# Altium schematic sheet Power Supply.SchDoc: =ProjectTitle
size 297 x 209 mm; Address1: Address1; Address2: Address2; Address3: Address3; Address4: Address4; SheetNumber: 1; SheetTotal: 16; Scale: 1:1; DocumentType: Схема электрическая принципиальная
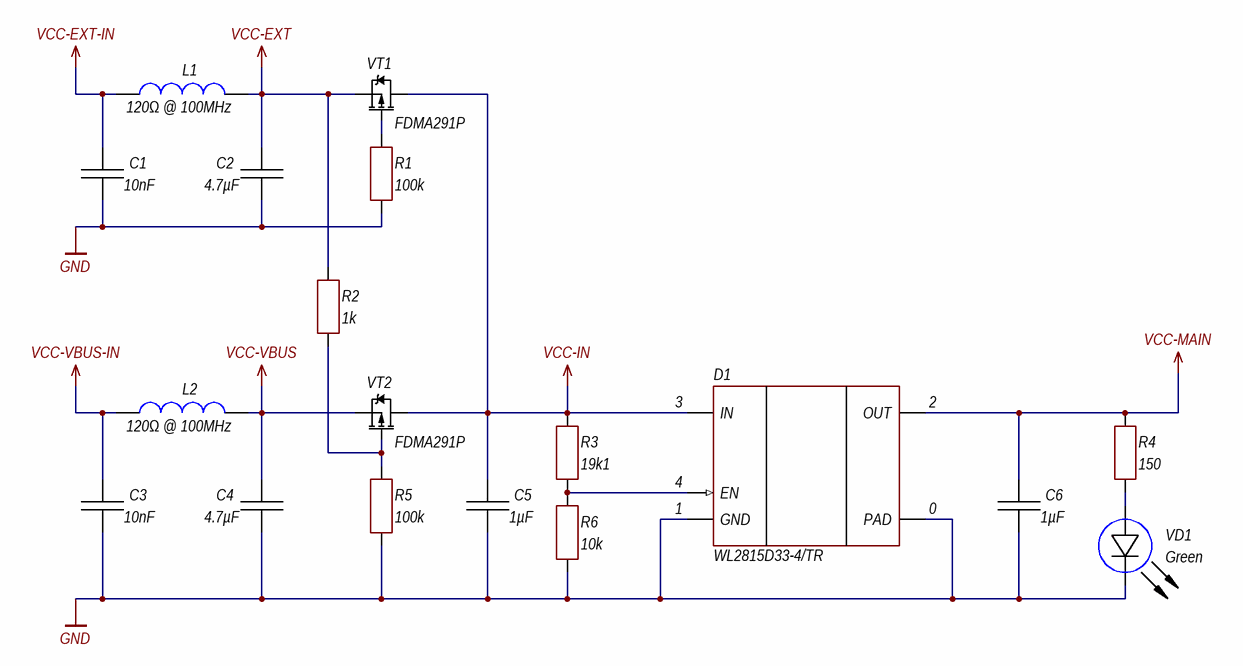
[diagram p0: Power Supply.SchDoc]

## Parts
C1  10nF  [CH0805CM]
C2  4.7µF  [CH0805CM]
C3  10nF  [CH0805CM]
C4  4.7µF  [CH0805CM]
C5  1µF  [CH0402C]
C6  1µF  [CH0402C]
D1  WL2815D33-4/TR  [DFN1010-4]
L1  120Ω @ 100MHz  [CH0805LM]
L2  120Ω @ 100MHz  [CH0805LM]
R1  100k  [CH0402R]
R2  1k  [CH0402R]
R3  19k1  [CH0402R]
R4  150  [CH0402R]
R5  100k  [CH0402R]
R6  10k  [CH0402R]
VD1  Green  [CH0402LG]
VT1  FDMA291P  [MicroFET 2x2]
VT2  FDMA291P  [MicroFET 2x2]

## Nets
GND: C1.1 C2.1 C3.1 C4.1 C5.1 C6.1 D1.0(PAD) D1.1(GND) R1.1 R5.1 R6.1 VD1.2(C)
VCC-EXT: C2.2 L1.1 R2.2 VT1.3(S)
VCC-EXT-IN: C1.2 L1.2
VCC-IN: C5.2 D1.3(IN) R3.2 VT1.2(D) VT2.2(D)
VCC-MAIN: C6.2 D1.2(OUT) R4.2
VCC-VBUS: C4.2 L2.1 VT2.3(S)
VCC-VBUS-IN: C3.2 L2.2
NetD1_4: D1.4(EN) R3.1 R6.2
NetR1_2: R1.2 VT1.1(G)
NetR2_1: R2.1 R5.2 VT2.1(G)
NetR4_1: R4.1 VD1.1(A)

## Notes on the sheet
- Утв.
- Н.контр.
- Т.контр.
- Пров.
- Разраб.
- Изм.
- Лист
- № докум.
- Подп.
- Дата
- Копировал
- Формат А4
- Лит.
- Листов
- Масса
- Масштаб

## Library data of the parts
C1-C6 = Capacitor: Manufacturer: *; Model: *; HelpURL: *; ComponentKind: *
  C1 C3: Value: 10nF
  C2 C4: Value: 4.7µF
  C5 C6: Value: 1µF
D1 = WL2815: LDO; Model: WL2815D33-4/TR; HelpURL: https://www.lcsc.com/product-detail/Linear-Voltage-Regulators-LDO_WILLSEMI-Will-Semicon-WL2815D33-4-TR_C506126.html; ComponentKind: DFN1010-4, 5.25V, 300mA
L1 L2 = Inductor: Manufacturer: *; Model: *; HelpURL: *; ComponentKind: *; Value: 120Ω @ 100MHz
R1-R6 = Resistor: Manufacturer: *; Model: *; HelpURL: *; ComponentKind: *
  R1 R5: Value: 100k
  R2: Value: 1k
  R3: Value: 19k1
  R4: Value: 150
  R6: Value: 10k
VD1 = LED: Manufacturer: *; Model: *; HelpURL: *; ComponentKind: *; Value: Green
VT1 VT2 = P-chanel: Mosfet; pin to pad: 1>3 2>1 3>2; Manufacturer: Fairchild Semiconductor; Model: FDMA291P; ComponentKind: -20V, -1V, 6.6A; HelpURL: https://www.chipdip.ru/product/fdma291p